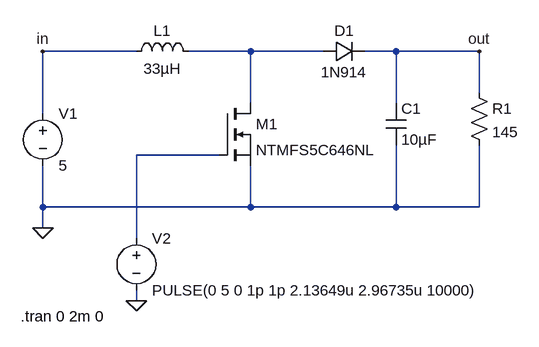
[diagram p0: schematic boostconv.asc]
boostconv.asc, the LTspice schematic file:
Version 4
SHEET 1 880 680
WIRE 96 64 -48 64
WIRE 272 64 176 64
WIRE 384 64 272 64
WIRE 496 64 448 64
WIRE 624 64 496 64
WIRE 624 128 624 64
WIRE 272 144 272 64
WIRE 496 144 496 64
WIRE -48 160 -48 64
WIRE 224 224 96 224
WIRE -48 304 -48 240
WIRE 272 304 272 240
WIRE 272 304 -48 304
WIRE 496 304 496 208
WIRE 496 304 272 304
WIRE 624 304 624 208
WIRE 624 304 496 304
WIRE -48 336 -48 304
WIRE 96 352 96 224
WIRE 96 448 96 432
FLAG -48 336 0
FLAG 96 448 0
FLAG 624 64 out
FLAG -48 64 in
SYMBOL voltage -48 144 R0
WINDOW 123 0 0 Left 0
WINDOW 39 0 0 Left 0
SYMATTR InstName V1
SYMATTR Value 5
SYMBOL nmos 224 144 R0
SYMATTR InstName M1
SYMATTR Value NTMFS5C646NL
SYMBOL voltage 96 336 R0
WINDOW 123 0 0 Left 0
WINDOW 39 0 0 Left 0
SYMATTR InstName V2
SYMATTR Value PULSE(0 5 0 1p 1p 2.13649u 2.96735u 10000)
SYMBOL ind 80 80 R270
WINDOW 0 32 56 VTop 2
WINDOW 3 5 56 VBottom 2
SYMATTR InstName L1
SYMATTR Value 33µH
SYMBOL diode 384 80 R270
WINDOW 0 32 32 VTop 2
WINDOW 3 0 32 VBottom 2
SYMATTR InstName D1
SYMATTR Value 1N914
SYMBOL cap 480 144 R0
SYMATTR InstName C1
SYMATTR Value 10µF
SYMBOL res 608 112 R0
SYMATTR InstName R1
SYMATTR Value 145
TEXT -82 472 Left 2 !.tran 0 2m 0

The netlist it stands for:
* boostconv.asc
V1 in 0 5
M1 N001 N002 0 0 NTMFS5C646NL
V2 N002 0 PULSE(0 5 0 1p 1p 2.13649u 2.96735u 10000)
L1 in N001 33µH
D1 N001 out 1N914
C1 out 0 10µF
R1 out 0 145
.model D D
.lib standard.dio
.model NMOS NMOS
.model PMOS PMOS
.lib standard.mos
.tran 0 2m 0
.backanno
.end